# Altium project RS_485_MySensor.PrjPcb
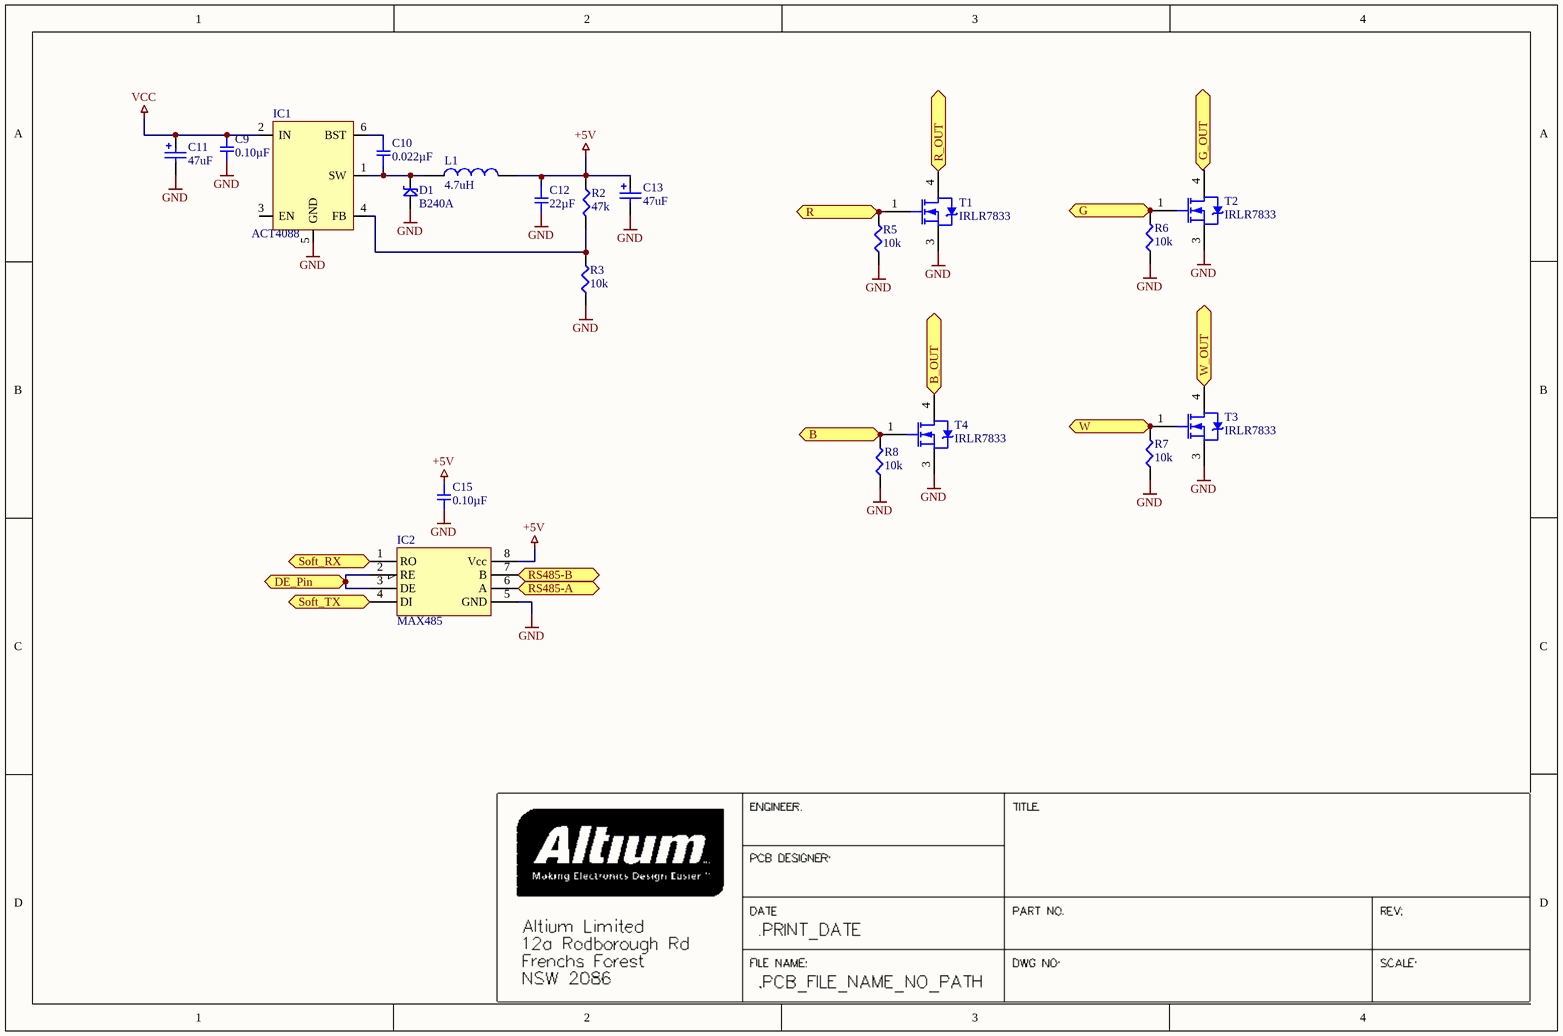
[diagram p0: RS485_RGB_Power.SchDoc]
3 sheets, 42 parts. Net scope: flat (ports and power ports of the same name join across sheets).
Board file: RS_485_MySensor.PcbDoc
Sheets:
  RS485_RGB_Power.SchDoc
  RS485_RGB_Connector.SchDoc
  RS485_RGB_Atmega328.SchDoc

## Sheet RS485_RGB_Power.SchDoc
size A4; Organization: Altium Limited; Address1: L3, 12a Rodborough Rd; Address2: Frenchs Forest; Address3: NSW; Address4: Australia 2086

### Parts
C9  0.10µF  [SMD-0603C]
C10  0.022µF  [SMD-0603C]
C11  value 47uF  [WCAP-ASLI_6.3x5.5]  (hidden comment: 865080543009)
C12  22µF  [SMD-0603C]
C13  value 47uF  [WCAP-ASLI_6.3x5.5]  (hidden comment: 865080543009)
C15  0.10µF  [SMD-0603C]
D1  B240A  [B240A]
IC1  ACT4088  [SOT23-6]
IC2  MAX485  [D008_L]
L1  value 4.7uH  [WE-TPC_2813]  (hidden comment: 744029004)
R2  47k  [SMD-0603-RES]
R3  10k  [SMD-0603-RES]
R5  10k  [SMD-0603-RES]
R6  10k  [SMD-0603-RES]
R7  10k  [SMD-0603-RES]
R8  10k  [SMD-0603-RES]
T1  IRLR7833  [ONSC-DPAK-3-369C-01_V]
T2  IRLR7833  [ONSC-DPAK-3-369C-01_V]
T3  IRLR7833  [ONSC-DPAK-3-369C-01_V]
T4  IRLR7833  [ONSC-DPAK-3-369C-01_V]

### Ports
B, B_OUT, DE_Pin, G, G_OUT, R, R_OUT, RS485-A, RS485-B, Soft_RX, Soft_TX, W, W_OUT

### Nets
+5V: C12.1 C13.1(P) C15.1 IC2.8(Vcc) L1.2 R2.1
GND: C9.2 C11.2(N) C12.2 C13.2(N) C15.2 D1.A IC1.5(GND) IC2.5(GND) R3.1 R5.1 R6.1 R7.1 R8.1 T1.3(S) T2.3(S) T3.3(S) T4.3(S)
VCC: C9.1 C11.1(P) IC1.2(IN)
NetC8_5: R6.2 T2.1(G) ; port G
NetC10_1: C10.1 IC1.6(BST)
NetC10_2: C10.2 D1.K IC1.1(SW) L1.1
NetIC1_4: IC1.4(FB) R2.2 R3.2
NetIC2_1: IC2.1(RO) ; port Soft_RX
NetIC2_2: IC2.2(RE) IC2.3(DE) ; port DE_Pin
NetIC2_4: IC2.4(DI) ; port Soft_TX
NetIC2_6: IC2.6(A) ; port RS485-A
NetIC2_7: IC2.7(B) ; port RS485-B
NetJ?#1_2: T1.4(D) ; port R_OUT
NetJ?#1_3: T2.4(D) ; port G_OUT
NetJ?#3_1: T4.4(D) ; port B_OUT
NetJ?#3_2: T3.4(D) ; port W_OUT
NetR5_2: R5.2 T1.1(G) ; port R
NetR7_2: R7.2 T3.1(G) ; port W
NetR8_2: R8.2 T4.1(G) ; port B

Not connected (* = marked no-connect by the designer): IC1 3(EN)

### Library data of the parts
C9 C15 = GCJ188R72A104KA01D: CAP CER 0.1UF 100V X7R 0603; Manufacturer: Murata Electronics North America; Factory Stock: 0; Unit Price (USD): 0.23; Minimum Quantity: 1; Tolerance: ±10%; Datasheets: http://www.murata.com/~/media/webrenewal/support/library/catalog/products/capacitor/mlcc/c03e.ashx; Image: //media.digikey.com/Renders/Murata%20Renders/0603%28LQG18%29.jpg; Digi-Key Part Number: 490-13420-1-ND; Part Number: GCJ188R72A104KA01D; Quantity Available: 2728; @ qty: 0; Packaging: Cut Tape (CT); Series: GCJ; Part Status: Active; Value: 0.10µF; Voltage: 100V; Temperature Coefficient: X7R; Operating Temperature: -55°C ~ 125°C; Features: Soft Termination; Ratings: AEC-Q200; Applications: Automotive, Boardflex Sensitive; Mounting Type: Surface Mount, MLCC; Package / Case: 0603 (1608 Metric); Size / Dimension: 0.063" L x 0.031" W (1.60mm x 0.80mm); Height - Seated (Max): -; Thickness (Max): 0.035" (0.90mm); Lead Spacing: -; Lead Style: -
C10 = GCJ188R71H223KA01D: CAP CER 0.022UF 50V X7R 0603; Manufacturer: Murata Electronics North America; Factory Stock: 0; Unit Price (USD): 0.22; Minimum Quantity: 1; Tolerance: ±10%; Datasheets: http://www.murata.com/~/media/webrenewal/support/library/catalog/products/capacitor/mlcc/c03e.ashx; Image: //media.digikey.com/Renders/Murata%20Renders/0603%28LQG18%29.jpg; Digi-Key Part Number: 490-5851-1-ND; Part Number: GCJ188R71H223KA01D; Quantity Available: 7651; @ qty: 0; Packaging: Cut Tape (CT); Series: GCJ; Part Status: Active; Value: 0.022µF; Voltage: 50V; Temperature Coefficient: X7R; Operating Temperature: -55°C ~ 125°C; Features: Soft Termination; Ratings: AEC-Q200; Applications: Automotive, Boardflex Sensitive; Mounting Type: Surface Mount, MLCC; Package / Case: 0603 (1608 Metric); Size / Dimension: 0.063" L x 0.031" W (1.60mm x 0.80mm); Height - Seated (Max): -; Thickness (Max): 0.031" (0.80mm); Lead Spacing: -; Lead Style: -
C11 C13 = 865080543009: WCAP-ASLI Aluminum Electrolytic Capacitors, size Ф6.3x5.5mm, 35V DC, 47uF; Rated Voltage: 35V DC; ComponentLink1Description: Manufacturer; ComponentLink1URL: http://www.we-online.de; ComponentLink2Description: Datasheet; ComponentLink2URL: http://katalog.we-online.de/pbs/datasheet/865080543009.pdf; Part Number: 865080543009; Published Date: June 2017; Publisher: Wurth Elektronik; Size: Ф6.3x5.5mm; Life Cycle: 2000h; Operating Temperature: -55 °C up to +105 °C
C12 = GRM186R60G226ME15D: CAP CER 22UF 4V X5R 0603; Manufacturer: Murata Electronics North America; Factory Stock: 0; Unit Price (USD): 0.32; Minimum Quantity: 1; Tolerance: ±20%; Datasheets: http://psearch.en.murata.com/capacitor/product/GRM186R60G226ME15%23.pdf; Image: //media.digikey.com/Renders/Murata%20Renders/ZRB-SERIES-0402.jpg; Digi-Key Part Number: 490-13240-1-ND; Part Number: GRM186R60G226ME15D; Quantity Available: 3630; @ qty: 0; Packaging: Cut Tape (CT); Series: GRM; Part Status: Active; Value: 22µF; Voltage: 4V; Temperature Coefficient: X5R; Operating Temperature: -55°C ~ 85°C; Features: -; Ratings: -; Applications: General Purpose; Mounting Type: Surface Mount, MLCC; Package / Case: 0603 (1608 Metric); Size / Dimension: 0.063" L x 0.031" W (1.60mm x 0.80mm); Height - Seated (Max): -; Thickness (Max): 0.028" (0.70mm); Lead Spacing: -; Lead Style: -
D1 = B240A: Shottkydiode
L1 = 744029004: WE-TPC SMD Shielded Tiny Power Inductor, size 2813, 1A, 170mΩ, 4.7uH; ComponentLink1Description: Manufacturer; ComponentLink1URL: http://www.we-online.de; ComponentLink2Description: Datasheet; ComponentLink2URL: http://katalog.we-online.de/pbs/datasheet/744029004.pdf; Part Number: 744029004; Published Date: July 2017; Publisher: Wurth Elektronik; Rated Current: 1A; Size: 2813; DC Resistance: 170mΩ
R2 = ERJ-3EKF4702V: RES SMD 47K OHM 1% 1/10W 0603; Manufacturer: Panasonic Electronic Components; Factory Stock: 0; Unit Price (USD): 0.00379; @ qty: 1500; Minimum Quantity: 1; Power (Watts): 0.1W, 1/10W; Temperature Coefficient: ±100ppm/°C; Part Number: ERJ-3EKF4702V; Datasheets: http://industrial.panasonic.com/www-cgi/jvcr13pz.cgi?E+PZ+3+AOA0002+ERJ3EKF4702V+7+WW; Image: //media.digikey.com/Photos/Panasonic%20Photos/MFG_ERJ-P6W%20Series.jpg; Digi-Key Part Number: P47.0KHCT-ND; Quantity Available: 3596527; Packaging: Cut Tape (CT); Series: ERJ; Part Status: Active; Value: 47k; Tolerance: ±1%; Composition: Thick Film; Features: Automotive AEC-Q200; Operating Temperature: -55°C ~ 155°C; Package / Case: 0603 (1608 Metric); Supplier Device Package: 0603; Size / Dimension: 0.063" L x 0.031" W (1.60mm x 0.80mm); Height - Seated (Max): 0.022" (0.55mm); Number of Terminations: 2; Failure Rate: -
R3 R5-R8 = ERJ-3EKF1002V: RES SMD 10K OHM 1% 1/10W 0603; Manufacturer: Panasonic Electronic Components; Factory Stock: 0; Unit Price (USD): 0.00379; @ qty: 1500; Minimum Quantity: 1; Power (Watts): 0.1W, 1/10W; Temperature Coefficient: ±100ppm/°C; Part Number: ERJ-3EKF1002V; Datasheets: http://industrial.panasonic.com/www-cgi/jvcr13pz.cgi?E+PZ+3+AOA0002+ERJ3EKF1002V+7+WW; Image: //media.digikey.com/Photos/Panasonic%20Photos/MFG_ERJ-P6W%20Series.jpg; Digi-Key Part Number: P10.0KHCT-ND; Quantity Available: 6703141; Packaging: Cut Tape (CT); Series: ERJ; Part Status: Active; Value: 10k; Tolerance: ±1%; Composition: Thick Film; Features: Automotive AEC-Q200; Operating Temperature: -55°C ~ 155°C; Package / Case: 0603 (1608 Metric); Supplier Device Package: 0603; Size / Dimension: 0.063" L x 0.031" W (1.60mm x 0.80mm); Height - Seated (Max): 0.022" (0.55mm); Number of Terminations: 2; Failure Rate: -
T1-T4 = IRLR7833: N-Channel MOSFET

## Sheet RS485_RGB_Connector.SchDoc
size A4; Organization: Altium Limited; Address1: L3, 12a Rodborough Rd; Address2: Frenchs Forest; Address3: NSW; Address4: Australia 2086
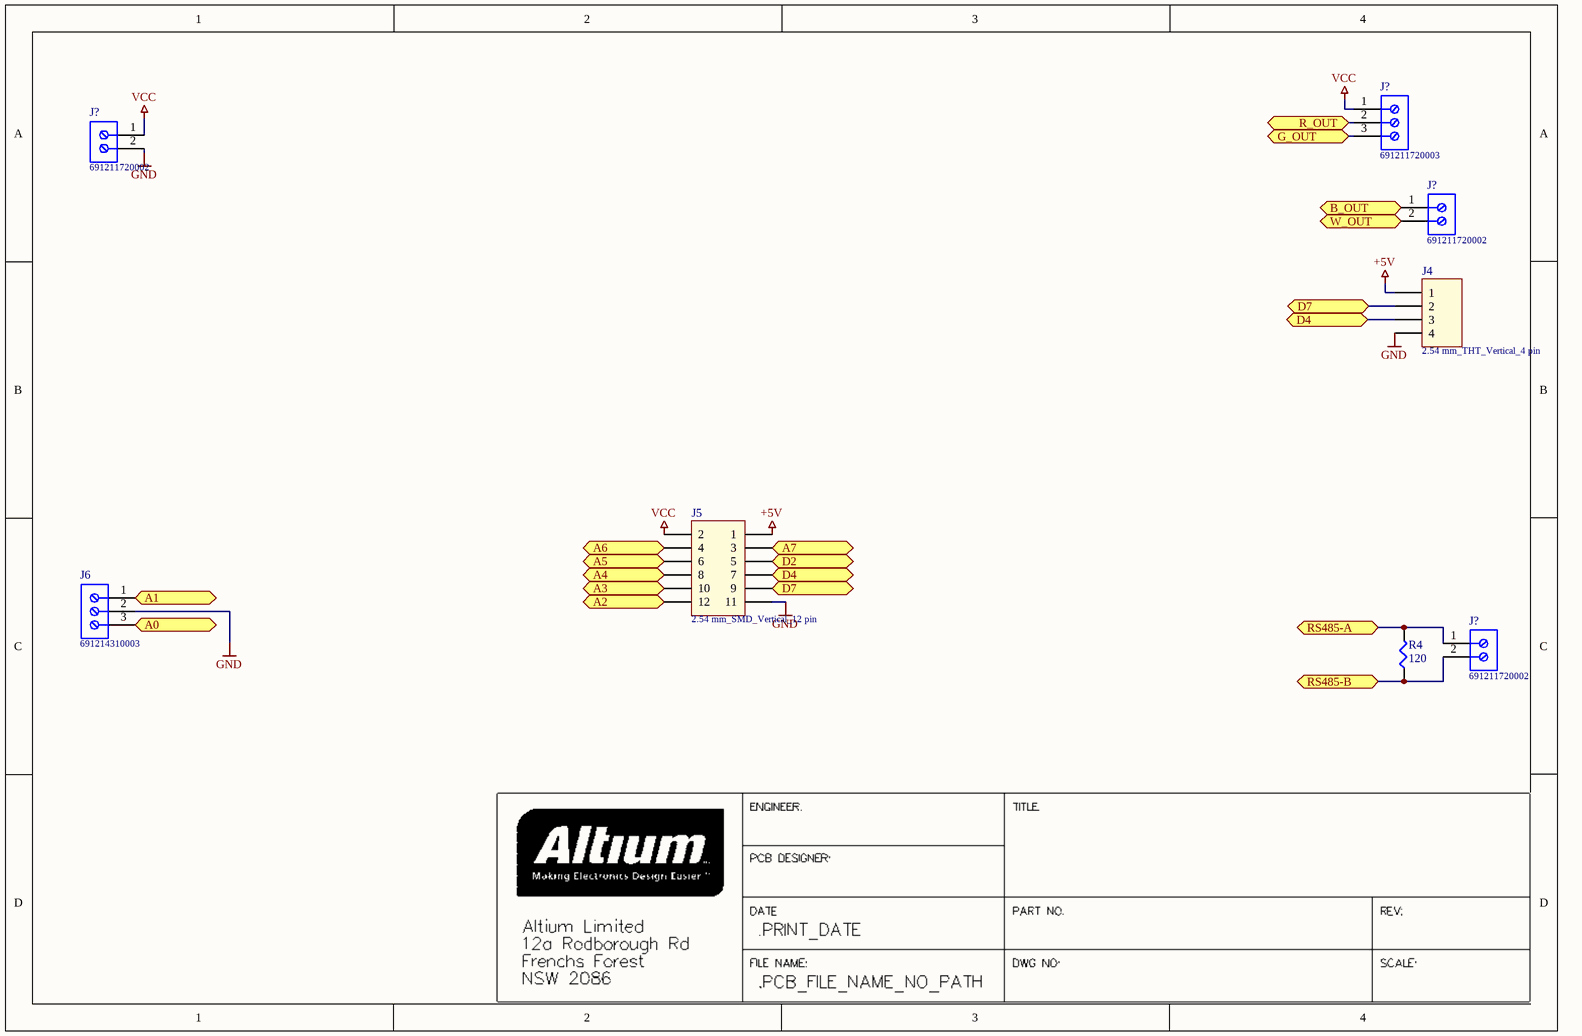
[diagram p1: RS485_RGB_Connector.SchDoc]

### Parts
(Parts that share a designator on the sheet are numbered #1, #2 ... from top to bottom, then left to right.)
J4  2.54 mm_THT_Vertical_4 pin  [61300411121]
J5  2.54 mm_SMD_Vertical_12 pin  [61001221121]
J6  691214310003  [691214310003]
J?#1  691211720003  [691211720003]
J?#2  691211720002  [691211720002]
J?#3  691211720002  [691211720002]
J?#4  691211720002  [691211720002]
R4  120  [SMD-0603-RES]

### Ports
A0, A1, A2, A3, A4, A5, A6, A7, B_OUT, D2, D4, D7, G_OUT, R_OUT, RS485-A, RS485-B, W_OUT

### Nets
+5V: J4.1 J5.1
GND: J4.4 J5.11 J6.2 J?#2.2
VCC: J5.2 J?#1.1 J?#2.1
NetIC2_6: J?#4.1 R4.2 ; port RS485-A
NetIC2_7: J?#4.2 R4.1 ; port RS485-B
NetJ4_2: J4.2 J5.9 ; port D7
NetJ4_3: J4.3 J5.7 ; port D4
NetJ5_3: J5.3 ; port A7
NetJ5_4: J5.4 ; port A6
NetJ5_5: J5.5 ; port D2
NetJ5_6: J5.6 ; port A5
NetJ5_8: J5.8 ; port A4
NetJ5_10: J5.10 ; port A3
NetJ5_12: J5.12 ; port A2
NetJ6_1: J6.1 ; port A1
NetJ6_3: J6.3 ; port A0
NetJ?#1_2: J?#1.2 ; port R_OUT
NetJ?#1_3: J?#1.3 ; port G_OUT
NetJ?#3_1: J?#3.1 ; port B_OUT
NetJ?#3_2: J?#3.2 ; port W_OUT

### Library data of the parts
J4 = 61300411121: Pin Header WR-PHD, pitch 2.54 mm, THT, Vertical, single row, 4 pin; Rated Current: 3 A; Pin Number: 4; Pitch: 2.54 mm; Working Voltage: 250 VAC; Contact Resistance: 20 mOhm; Insulation Resistance: >1000 MOhm; ComponentLink1Description: Manufacturer; ComponentLink1URL: http://www.we-online.de; ComponentLink2Description: Datasheet; ComponentLink2URL: http://katalog.we-online.de/em/datasheet/6130xx11121.pdf; Part Number: 61300411121; Published Date: Jan. 2018; Publisher: Wurth Elektronik; Operating Temperature: -40 to 105 degC; Mounting Technology: THT; Row Number: Single; Orientation: Vertical
J5 = 61001221121: Pin Header WR-PHD, pitch 2.54 mm, SMD, Vertical, dual row, 12 pin; Rated Current: 3 A; Pin Number: 12; Pitch: 2.54 mm; Working Voltage: 250 VAC; Contact Resistance: 20 mOhm; Insulation Resistance: >1000 MOhm; ComponentLink1Description: Manufacturer; ComponentLink1URL: http://www.we-online.de; ComponentLink2Description: Datasheet; ComponentLink2URL: http://katalog.we-online.de/em/datasheet/6100xx21121.pdf; Part Number: 61001221121; Published Date: Jan. 2018; Publisher: Wurth Elektronik; Operating Temperature: -40 to 105 degC; Mounting Technology: SMD; Row Number: Dual; Orientation: Vertical
J6 = 691214310003: Serie 2143 - 3.81 mm Horizontal Cable Entry with Rising Cage Clamp WR-TBL, 3 pin; Pin Number: 3; Pitch: 3.81 mm; ComponentLink1Description: Manufacturer; ComponentLink1URL: http://www.we-online.de; ComponentLink2Description: Datasheet; ComponentLink2URL: http://katalog.we-online.de/em/datasheet/6912143100xx.pdf; Part Number: 691214310003; Published Date: June 2018; Publisher: Wurth Elektronik; Operating Temperature: -40 to 105 degC; Mounting Technology: THT; Packaging: Box
J?#1 = 691211720003: Serie 211 - 5.00 mm 45deg Entry Modular with Rising Cage Clamp - 15.50 mm Height WR-TBL, 3 pin; Pin Number: 3; Pitch: 5.00 mm; ComponentLink1Description: Manufacturer; ComponentLink1URL: http://www.we-online.de; ComponentLink2Description: Datasheet; ComponentLink2URL: http://katalog.we-online.de/em/datasheet/6912117200xx.pdf; Part Number: 691211720003; Published Date: June 2018; Publisher: Wurth Elektronik; Operating Temperature: -40 to 105 degC; Mounting Technology: THT; Packaging: Box
J?#2-J?#4 = 691211720002: Serie 211 - 5.00 mm 45deg Entry Modular with Rising Cage Clamp - 15.50 mm Height WR-TBL, 2 pin; Pin Number: 2; Pitch: 5.00 mm; ComponentLink1Description: Manufacturer; ComponentLink1URL: http://www.we-online.de; ComponentLink2Description: Datasheet; ComponentLink2URL: http://katalog.we-online.de/em/datasheet/6912117200xx.pdf; Part Number: 691211720002; Published Date: June 2018; Publisher: Wurth Elektronik; Operating Temperature: -40 to 105 degC; Mounting Technology: THT; Packaging: Box
R4 = ERJ-3EKF1200V: RES SMD 120 OHM 1% 1/10W 0603; Manufacturer: Panasonic Electronic Components; Factory Stock: 0; Unit Price (USD): 0.00379; @ qty: 1500; Minimum Quantity: 1; Power (Watts): 0.1W, 1/10W; Temperature Coefficient: ±100ppm/°C; Part Number: ERJ-3EKF1200V; Datasheets: http://industrial.panasonic.com/www-cgi/jvcr13pz.cgi?E+PZ+3+AOA0002+ERJ3EKF1200V+7+WW; Image: //media.digikey.com/Photos/Panasonic%20Photos/MFG_ERJ-P6W%20Series.jpg; Digi-Key Part Number: P120HCT-ND; Quantity Available: 84623; Packaging: Cut Tape (CT); Series: ERJ; Part Status: Active; Value: 120; Tolerance: ±1%; Composition: Thick Film; Features: Automotive AEC-Q200; Operating Temperature: -55°C ~ 155°C; Package / Case: 0603 (1608 Metric); Supplier Device Package: 0603; Size / Dimension: 0.063" L x 0.031" W (1.60mm x 0.80mm); Height - Seated (Max): 0.022" (0.55mm); Number of Terminations: 2; Failure Rate: -

## Sheet RS485_RGB_Atmega328.SchDoc
size A4
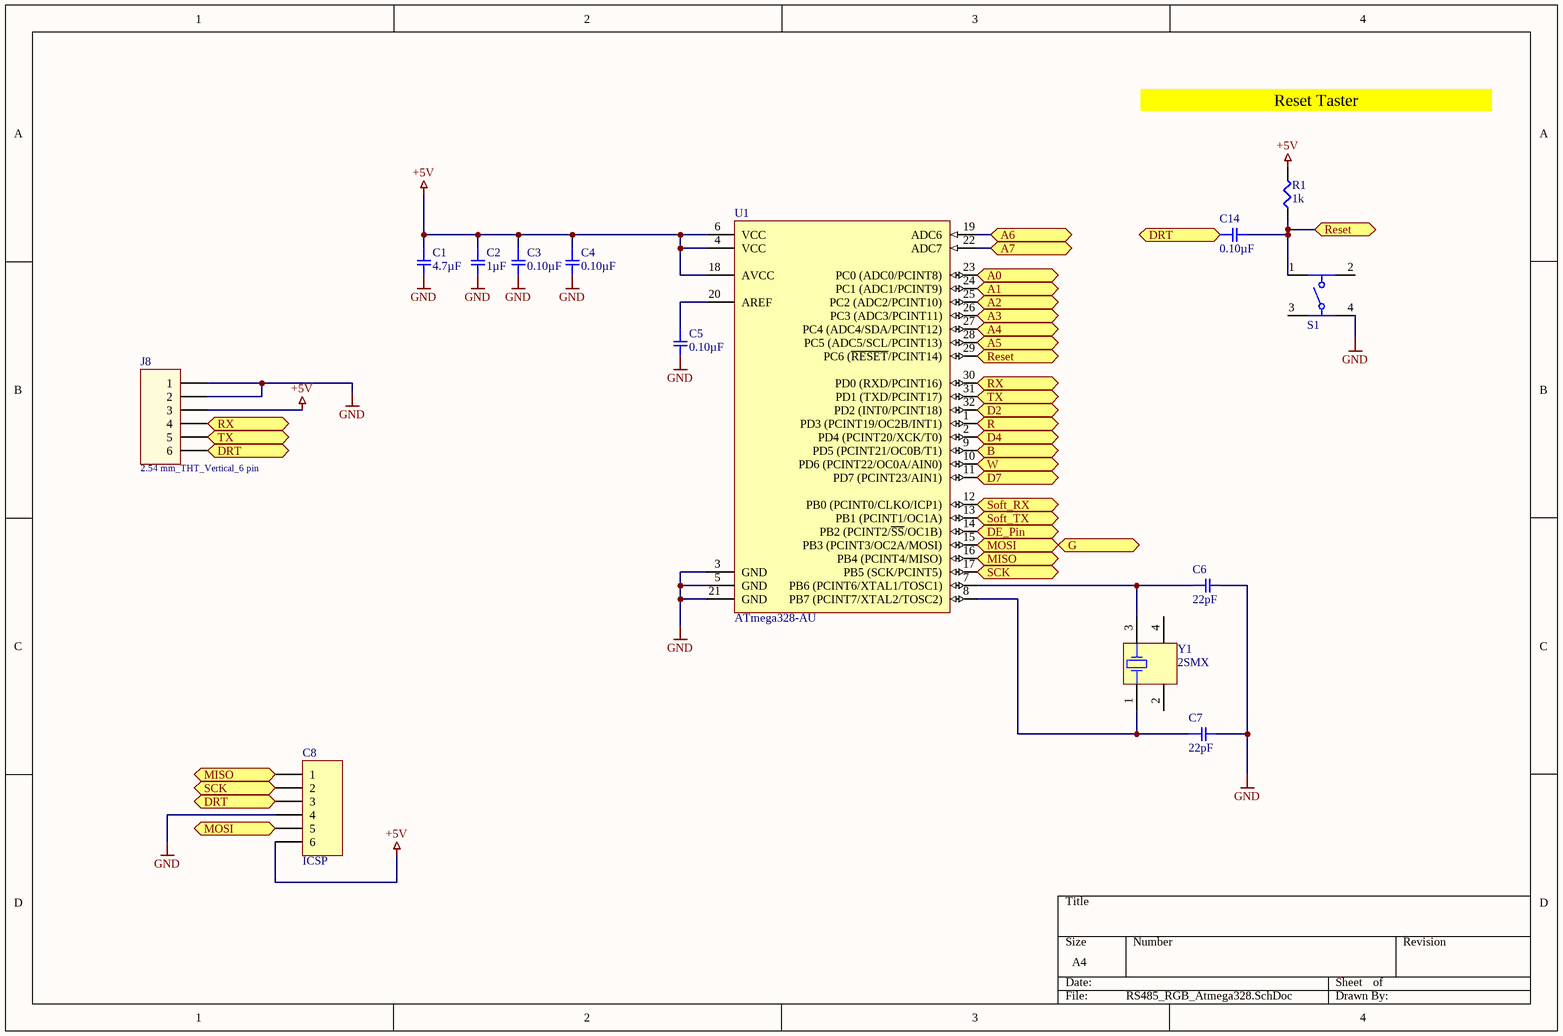
[diagram p2: RS485_RGB_Atmega328.SchDoc]

### Parts
C1  4.7µF  [SMD-0603C]
C2  1µF  [SMD-0603C]
C3  0.10µF  [SMD-0603C]
C4  0.10µF  [SMD-0603C]
C5  0.10µF  [SMD-0603C]
C6  22pF  [SMD-0603C]
C7  22pF  [SMD-0603C]
C8  ICSP  [TC2030-MCP-NL]
C14  0.10µF  [SMD-0603C]
J8  2.54 mm_THT_Vertical_6 pin  [61300611121]
R1  1k  [SMD-0603-RES]
S1  430453025836  [430453025836]  (value not drawn)
U1  ATmega328-AU  [32A_N]
Y1  2SMX  [2SMX]

### Ports
A0, A1, A2, A3, A4, A5, A6, A7, B, D2, D4, D7, DE_Pin, DRT, G, MISO, MOSI, R, Reset, RX, SCK, Soft_RX, Soft_TX, TX, W

### Nets
+5V: C1.1 C2.1 C3.1 C4.1 C8.6 J8.3 R1.2 U1.4(VCC) U1.6(VCC) U1.18(AVCC)
GND: C1.2 C2.2 C3.2 C4.2 C5.2 C6.2 C7.2 C8.4 J8.1 J8.2 S1.4 U1.3(GND) U1.5(GND) U1.21(GND)
NetC5_1: C5.1 U1.20(AREF)
NetC6_1: C6.1 U1.7(PB6_(PCINT6/XTAL1/TOSC1)) Y1.3(OSC2)
NetC7_1: C7.1 U1.8(PB7_(PCINT7/XTAL2/TOSC2)) Y1.1(OSC1)
NetC8_1: C8.1 U1.16(PB4_(PCINT4/MISO)) ; port MISO
NetC8_2: C8.2 U1.17(PB5_(SCK/PCINT5)) ; port SCK
NetC8_3: C8.3 C14.1 J8.6 ; port DRT
NetC8_5: C8.5 U1.15(PB3_(PCINT3/OC2A/MOSI)) ; port MOSI, port G
NetC14_2: C14.2 R1.1 S1.1 U1.29(PC6_(~{RESET}/PCINT14)) ; port Reset
NetIC2_1: U1.12(PB0_(PCINT0/CLKO/ICP1)) ; port Soft_RX
NetIC2_2: U1.14(PB2_(PCINT2/~{SS}/OC1B)) ; port DE_Pin
NetIC2_4: U1.13(PB1_(PCINT1/OC1A)) ; port Soft_TX
NetJ4_2: U1.11(PD7_(PCINT23/AIN1)) ; port D7
NetJ4_3: U1.2(PD4_(PCINT20/XCK/T0)) ; port D4
NetJ5_3: U1.22(ADC7) ; port A7
NetJ5_4: U1.19(ADC6) ; port A6
NetJ5_5: U1.32(PD2_(INT0/PCINT18)) ; port D2
NetJ5_6: U1.28(PC5_(ADC5/SCL/PCINT13)) ; port A5
NetJ5_8: U1.27(PC4_(ADC4/SDA/PCINT12)) ; port A4
NetJ5_10: U1.26(PC3_(ADC3/PCINT11)) ; port A3
NetJ5_12: U1.25(PC2_(ADC2/PCINT10)) ; port A2
NetJ6_1: U1.24(PC1_(ADC1/PCINT9)) ; port A1
NetJ6_3: U1.23(PC0_(ADC0/PCINT8)) ; port A0
NetJ8_4: J8.4 U1.30(PD0_(RXD/PCINT16)) ; port RX
NetJ8_5: J8.5 U1.31(PD1_(TXD/PCINT17)) ; port TX
NetR5_2: U1.1(PD3_(PCINT19/OC2B/INT1)) ; port R
NetR7_2: U1.10(PD6_(PCINT22/OC0A/AIN0)) ; port W
NetR8_2: U1.9(PD5_(PCINT21/OC0B/T1)) ; port B

Not connected (* = marked no-connect by the designer): S1 2 3; Y1 2(NC) 4(NC)

### Notes on the sheet
- Reset Taster

### Library data of the parts
C1 = GRM188C80G475KE19D: CAP CER 4.7UF 4V X6S 0603; Manufacturer: Murata Electronics North America; Factory Stock: 0; Unit Price (USD): 0.11; Minimum Quantity: 1; Tolerance: ±10%; Datasheets: http://www.murata.com/~/media/webrenewal/support/library/catalog/products/capacitor/mlcc/c02e.pdf; Image: //media.digikey.com/Renders/Murata%20Renders/ZRB-SERIES-0402.jpg; Digi-Key Part Number: 490-6402-1-ND; Part Number: GRM188C80G475KE19D; Quantity Available: 22219; @ qty: 0; Packaging: Cut Tape (CT); Series: GRM; Part Status: Active; Value: 4.7µF; Voltage: 4V; Temperature Coefficient: X6S; Operating Temperature: -55°C ~ 105°C; Features: -; Ratings: -; Applications: General Purpose; Mounting Type: Surface Mount, MLCC; Package / Case: 0603 (1608 Metric); Size / Dimension: 0.063" L x 0.031" W (1.60mm x 0.80mm); Height - Seated (Max): -; Thickness (Max): 0.035" (0.90mm); Lead Spacing: -; Lead Style: -
C2 = GRM185C81A105KE36D: CAP CER 1UF 10V X6S 0603; Manufacturer: Murata Electronics North America; Factory Stock: 0; Unit Price (USD): 0.2; Minimum Quantity: 1; Tolerance: ±10%; Datasheets: http://www.murata.com/~/media/webrenewal/support/library/catalog/products/capacitor/mlcc/c02e.pdf; Image: //media.digikey.com/Renders/Murata%20Renders/ZRB-SERIES-0402.jpg; Digi-Key Part Number: 490-11987-1-ND; Part Number: GRM185C81A105KE36D; Quantity Available: 4005; @ qty: 0; Packaging: Cut Tape (CT); Series: GRM; Part Status: Active; Value: 1µF; Voltage: 10V; Temperature Coefficient: X6S; Operating Temperature: -55°C ~ 105°C; Features: -; Ratings: -; Applications: General Purpose; Mounting Type: Surface Mount, MLCC; Package / Case: 0603 (1608 Metric); Size / Dimension: 0.063" L x 0.031" W (1.60mm x 0.80mm); Height - Seated (Max): -; Thickness (Max): 0.020" (0.50mm); Lead Spacing: -; Lead Style: -
C3-C5 C14 = GCJ188R72A104KA01D: as C9 on sheet RS485_RGB_Power; Datasheets: http://www.murata.com/~/media/webrenewal/support/library/catalog/products/capacitor/mlcc/c03e.ashx; Image: //media.digikey.com/Renders/Murata%20Renders/0603%28LQG18%29.jpg; Digi-Key Part Number: 490-13420-1-ND; Part Number: GCJ188R72A104KA01D; Quantity Available: 2728; @ qty: 0; Packaging: Cut Tape (CT); Series: GCJ; Part Status: Active; Value: 0.10µF; Voltage: 100V; Temperature Coefficient: X7R; Operating Temperature: -55°C ~ 125°C; Features: Soft Termination; Ratings: AEC-Q200; Applications: Automotive, Boardflex Sensitive; Mounting Type: Surface Mount, MLCC; Package / Case: 0603 (1608 Metric); Size / Dimension: 0.063" L x 0.031" W (1.60mm x 0.80mm); Height - Seated (Max): -; Thickness (Max): 0.035" (0.90mm); Lead Spacing: -; Lead Style: -
C6 C7 = GCM1885C1H220JA16D: CAP CER 22PF 50V NP0 0603; Manufacturer: Murata Electronics North America; Factory Stock: 0; Unit Price (USD): 0.1; Minimum Quantity: 1; Tolerance: ±5%; Temperature Coefficient: C0G, NP0; Datasheets: http://www.murata.com/~/media/webrenewal/support/library/catalog/products/capacitor/mlcc/c03e.ashx; Image: //media.digikey.com/Renders/Murata%20Renders/0603%28GCM188%29.jpg; Digi-Key Part Number: 490-4958-1-ND; Part Number: GCM1885C1H220JA16D; Quantity Available: 95195; @ qty: 0; Packaging: Cut Tape (CT); Series: GCM; Part Status: Active; Value: 22pF; Voltage: 50V; Operating Temperature: -55°C ~ 125°C; Features: -; Ratings: AEC-Q200; Applications: Automotive; Mounting Type: Surface Mount, MLCC; Package / Case: 0603 (1608 Metric); Size / Dimension: 0.063" L x 0.031" W (1.60mm x 0.80mm); Height - Seated (Max): -; Thickness (Max): 0.035" (0.90mm); Lead Spacing: -; Lead Style: -
J8 = 61300611121: Pin Header WR-PHD, pitch 2.54 mm, THT, Vertical, single row, 6 pin; Rated Current: 3 A; Pin Number: 6; Pitch: 2.54 mm; Working Voltage: 250 VAC; Contact Resistance: 20 mOhm; Insulation Resistance: >1000 MOhm; ComponentLink1Description: Manufacturer; ComponentLink1URL: http://www.we-online.de; ComponentLink2Description: Datasheet; ComponentLink2URL: http://katalog.we-online.de/em/datasheet/6130xx11121.pdf; Part Number: 61300611121; Published Date: Jan. 2018; Publisher: Wurth Elektronik; Operating Temperature: -40 to 105 degC; Mounting Technology: THT; Row Number: Single; Orientation: Vertical
R1 = ERJ-3EKF1001V: RES SMD 1K OHM 1% 1/10W 0603; Manufacturer: Panasonic Electronic Components; Factory Stock: 0; Unit Price (USD): 0.00379; @ qty: 1500; Minimum Quantity: 1; Power (Watts): 0.1W, 1/10W; Temperature Coefficient: ±100ppm/°C; Part Number: ERJ-3EKF1001V; Datasheets: http://industrial.panasonic.com/www-cgi/jvcr13pz.cgi?E+PZ+3+AOA0002+ERJ3EKF1001V+7+WW; Image: //media.digikey.com/Photos/Panasonic%20Photos/MFG_ERJ-P6W%20Series.jpg; Digi-Key Part Number: P1.00KHCT-ND; Quantity Available: 5218845; Packaging: Cut Tape (CT); Series: ERJ; Part Status: Active; Value: 1k; Tolerance: ±1%; Composition: Thick Film; Features: Automotive AEC-Q200; Operating Temperature: -55°C ~ 155°C; Package / Case: 0603 (1608 Metric); Supplier Device Package: 0603; Size / Dimension: 0.063" L x 0.031" W (1.60mm x 0.80mm); Height - Seated (Max): 0.022" (0.55mm); Number of Terminations: 2; Failure Rate: -
S1 = 430453025836: 6x6mm SMD J-Bend washable WS-TASV, height 2.5 mm, 360 gf; Rated Current: 50 mA; Operation Force: 360 gf; Rated Voltage: 12 VDC; ComponentLink1Description: Manufacturer; ComponentLink1URL: http://www.we-online.de; ComponentLink2Description: Datasheet; ComponentLink2URL: http://katalog.we-online.de/em/datasheet/4304x3xxx8x6.pdf; Part Number: 430453025836; Published Date: Nov. 2017; Publisher: Wurth Elektronik; Life Cycle: 200000; Operating Temperature: -40 to +85 degC; Size: 6x6x2.5 mm
U1 = ATmega328-AU: 8-bit AVR Microcontroller, 32KB Flash, 1KB EEPROM, 2KB SRAM, 32-pin TQFP, Industrial Grade (-40°C to 85°C); Published: 1-Apr-2010; DatasheetVersion: revA, Jan-2010; PackageVersion: revB, Oct-2001; PackageReference: 32A; Publisher: Altium Limited; PackageDescription: 32-Lead, 7x7x1.0 mm Body, 0.8mm Lead Pitch, Thin Profile Plastic Quad Flat Package (TQFP); Supplier 1: Digi-Key; Supplier Part Number 1: ATMEGA328-AU-ND; Supplier 2: Mouser; Supplier Part Number 2: 556-ATMEGA328-AU; Code_JEDEC: MS-026-ABA; ComponentLink1Description: Manufacturer Link; ComponentLink1URL: http://www.atmel.com/products/avr/default.asp?; ComponentLink2Description: ATmega48A/48PA/88A/88PA/168A/168PA/328/328P Datasheet; ComponentLink2URL: http://www.atmel.com/dyn/resources/prod_documents/8271.pdf; ComponentLink3Description: ATmega48A/48PA/88A/88PA/168A/168PA/328/328P Summary; ComponentLink3URL: http://www.atmel.com/dyn/resources/prod_documents/8271S.pdf; ComponentLink4Description: Atmel.com Home; ComponentLink4URL: http://www.atmel.com
Y1 = 2SMX: Surface Mount Quartz Crystal; Note: PCB layout complies with manufacturer's recommendation.; Published: 17-Jul-2002; DatasheetDocument: 9-Sep-1999; PackageDocument: 9-Sep-1999; PackageReference: 2SMX; Publisher: Altium Limited; ComponentLink1Description: Manufacturer Link; ComponentLink1URL: http://www.cmac.com/mt/

## Nets that join several sheets
+5V: RS485_RGB_Power (6 pins), RS485_RGB_Connector (J4.1 J5.1), RS485_RGB_Atmega328 (10 pins)
GND: RS485_RGB_Power (17 pins), RS485_RGB_Connector (J4.4 J5.11 J6.2 J?#2.2), RS485_RGB_Atmega328 (14 pins)
VCC: RS485_RGB_Power (C9.1 C11.1 IC1.2), RS485_RGB_Connector (J5.2 J?#1.1 J?#2.1)
NetC8_5: RS485_RGB_Power (R6.2 T2.1), RS485_RGB_Atmega328 (C8.5 U1.15)
NetIC2_1: RS485_RGB_Power (IC2.1), RS485_RGB_Atmega328 (U1.12)
NetIC2_2: RS485_RGB_Power (IC2.2 IC2.3), RS485_RGB_Atmega328 (U1.14)
NetIC2_4: RS485_RGB_Power (IC2.4), RS485_RGB_Atmega328 (U1.13)
NetIC2_6: RS485_RGB_Power (IC2.6), RS485_RGB_Connector (J?#4.1 R4.2)
NetIC2_7: RS485_RGB_Power (IC2.7), RS485_RGB_Connector (J?#4.2 R4.1)
NetJ4_2: RS485_RGB_Connector (J4.2 J5.9), RS485_RGB_Atmega328 (U1.11)
NetJ4_3: RS485_RGB_Connector (J4.3 J5.7), RS485_RGB_Atmega328 (U1.2)
NetJ5_3: RS485_RGB_Connector (J5.3), RS485_RGB_Atmega328 (U1.22)
NetJ5_4: RS485_RGB_Connector (J5.4), RS485_RGB_Atmega328 (U1.19)
NetJ5_5: RS485_RGB_Connector (J5.5), RS485_RGB_Atmega328 (U1.32)
NetJ5_6: RS485_RGB_Connector (J5.6), RS485_RGB_Atmega328 (U1.28)
NetJ5_8: RS485_RGB_Connector (J5.8), RS485_RGB_Atmega328 (U1.27)
NetJ5_10: RS485_RGB_Connector (J5.10), RS485_RGB_Atmega328 (U1.26)
NetJ5_12: RS485_RGB_Connector (J5.12), RS485_RGB_Atmega328 (U1.25)
NetJ6_1: RS485_RGB_Connector (J6.1), RS485_RGB_Atmega328 (U1.24)
NetJ6_3: RS485_RGB_Connector (J6.3), RS485_RGB_Atmega328 (U1.23)
NetJ?#1_2: RS485_RGB_Power (T1.4), RS485_RGB_Connector (J?#1.2)
NetJ?#1_3: RS485_RGB_Power (T2.4), RS485_RGB_Connector (J?#1.3)
NetJ?#3_1: RS485_RGB_Power (T4.4), RS485_RGB_Connector (J?#3.1)
NetJ?#3_2: RS485_RGB_Power (T3.4), RS485_RGB_Connector (J?#3.2)
NetR5_2: RS485_RGB_Power (R5.2 T1.1), RS485_RGB_Atmega328 (U1.1)
NetR7_2: RS485_RGB_Power (R7.2 T3.1), RS485_RGB_Atmega328 (U1.10)
NetR8_2: RS485_RGB_Power (R8.2 T4.1), RS485_RGB_Atmega328 (U1.9)